# Altium schematic sheet connector.SchDoc
size A4; SheetNumber: 2; SheetTotal: 4
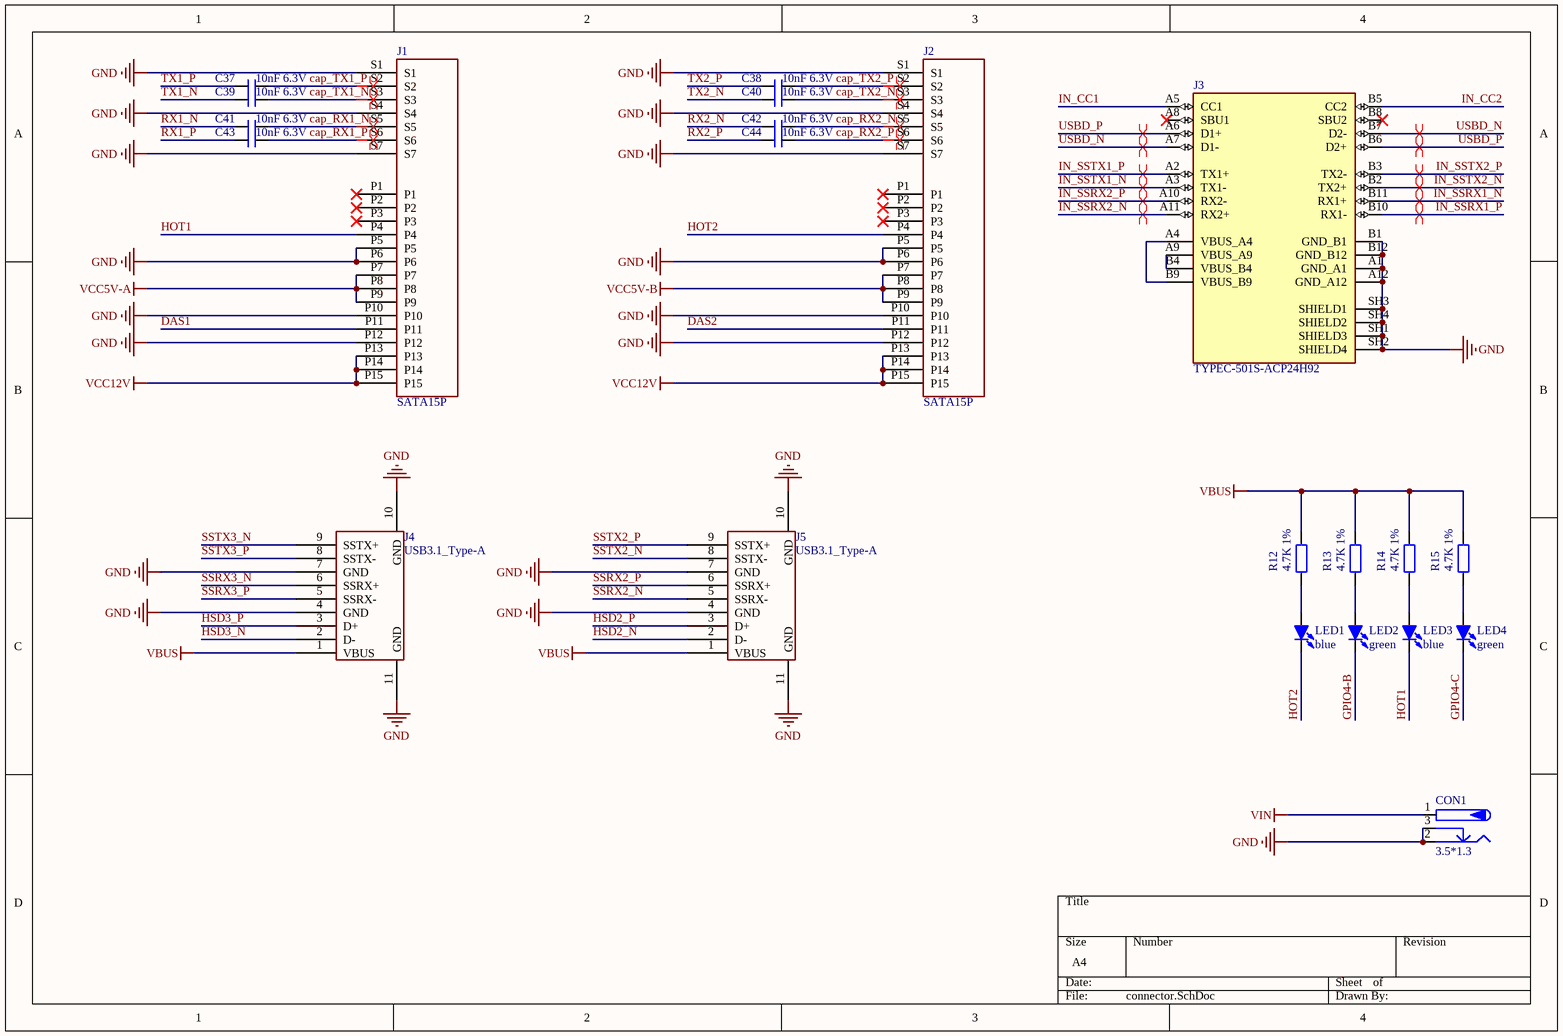
[diagram p0: connector.SchDoc]

## Parts
C37  10nF 6.3V  [C0402_L]
C38  10nF 6.3V  [C0402_L]
C39  10nF 6.3V  [C0402_L]
C40  10nF 6.3V  [C0402_L]
C41  10nF 6.3V  [C0402_L]
C42  10nF 6.3V  [C0402_L]
C43  10nF 6.3V  [C0402_L]
C44  10nF 6.3V  [C0402_L]
CON1  3.5*1.3  [DC-012G-2.5]
J1  SATA15P  [SATA 15P 贴片]
J2  SATA15P  [SATA 15P 贴片]
J3  TYPEC-501S-ACP24H92  [TypeC 24p 直立]
J4  USB3.1_Type-A  [USB3.1_Type-A 立式直插]
J5  USB3.1_Type-A  [USB3.1_Type-A 立式直插]
LED1  blue  [LED 0805B]
LED2  green  [LED 0805G]
LED3  blue  [LED 0805B]
LED4  green  [LED 0805G]
R12  4.7K 1%  [R0402_L]
R13  4.7K 1%  [R0402_L]
R14  4.7K 1%  [R0402_L]
R15  4.7K 1%  [R0402_L]

## Nets
GND: CON1.2 CON1.3 J1.P5 J1.P6 J1.P10 J1.P12 J1.S1 J1.S4 J1.S7 J2.P5 J2.P6 J2.P10 J2.P12 J2.S1 J2.S4 J2.S7 J3.A1(GND_A1) J3.A12(GND_A12) J3.B1(GND_B1) J3.B12(GND_B12) J3.SH1(SHIELD3) J3.SH2(SHIELD4) J3.SH3(SHIELD1) J3.SH4(SHIELD2) J4.4(GND) J4.7(GND) J4.10(GND) J4.11(GND) J5.4(GND) J5.7(GND) J5.10(GND) J5.11(GND)
VBUS: J4.1(VBUS) J5.1(VBUS) R12.1 R13.1 R14.1 R15.1
VCC5V-A: J1.P7 J1.P8 J1.P9
VCC5V-B: J2.P7 J2.P8 J2.P9
VCC12V: J1.P13 J1.P14 J1.P15 J2.P13 J2.P14 J2.P15
VIN: CON1.1
cap_RX1_N: C41.1 J1.S5
cap_RX1_P: C43.1 J1.S6
cap_RX2_N: C42.1 J2.S5
cap_RX2_P: C44.1 J2.S6
cap_TX1_N: C39.1 J1.S3
cap_TX1_P: C37.1 J1.S2
cap_TX2_N: C40.1 J2.S3
cap_TX2_P: C38.1 J2.S2
DAS1: J1.P11
DAS2: J2.P11
GPIO4-B: LED2.2(K)
GPIO4-C: LED4.2(K)
HOT1: J1.P4 LED3.2(K)
HOT2: J2.P4 LED1.2(K)
HSD2_N: J5.2(D-)
HSD2_P: J5.3(D+)
HSD3_N: J4.2(D-)
HSD3_P: J4.3(D+)
IN_CC1: J3.A5(CC1)
IN_CC2: J3.B5(CC2)
IN_SSRX1_N: J3.B11(RX1+)
IN_SSRX1_P: J3.B10(RX1-)
IN_SSRX2_N: J3.A11(RX2+)
IN_SSRX2_P: J3.A10(RX2-)
IN_SSTX1_N: J3.A3(TX1-)
IN_SSTX1_P: J3.A2(TX1+)
IN_SSTX2_N: J3.B2(TX2+)
IN_SSTX2_P: J3.B3(TX2-)
RX1_N: C41.2
RX1_P: C43.2
RX2_N: C42.2
RX2_P: C44.2
SSRX2_N: J5.5(SSRX-)
SSRX2_P: J5.6(SSRX+)
SSRX3_N: J4.6(SSRX+)
SSRX3_P: J4.5(SSRX-)
SSTX2_N: J5.8(SSTX-)
SSTX2_P: J5.9(SSTX+)
SSTX3_N: J4.9(SSTX+)
SSTX3_P: J4.8(SSTX-)
TX1_N: C39.2
TX1_P: C37.2
TX2_N: C40.2
TX2_P: C38.2
USBD_N: J3.A7(D1-) J3.B7(D2-)
USBD_P: J3.A6(D1+) J3.B6(D2+)
NetJ3_A4: J3.A4(VBUS_A4) J3.B9(VBUS_B9)
NetJ3_A9: J3.A9(VBUS_A9) J3.B4(VBUS_B4)
NetLED1_1: LED1.1(A) R12.2
NetLED2_1: LED2.1(A) R13.2
NetLED3_1: LED3.1(A) R14.2
NetLED4_1: LED4.1(A) R15.2

Not connected (* = marked no-connect by the designer): J1 P1* P2* P3*; J2 P1* P2* P3*; J3 A8(SBU1)* B8(SBU2)*

## Layout directives
differential pair: cap_RX1_N, cap_RX1_P, cap_RX2_N, cap_RX2_P, cap_TX1_N, cap_TX1_P, cap_TX2_N, cap_TX2_P, IN_SSRX1_N, IN_SSRX1_P, IN_SSRX2_N, IN_SSRX2_P, IN_SSTX1_N, IN_SSTX1_P, IN_SSTX2_N, IN_SSTX2_P, USBD_N, USBD_P

## Library data of the parts
C37-C44 = C: 无极性贴片电容; 版权归属: 源创客; 材质: X7R; BOM名称: 无极性贴片电容; 学习资源: www.ooocke.com
CON1 = P-DC: 低压电源接口; BOM名称: DC电源接口; 版权归属: 源创客; 学习资源: www.ooocke.com
J3 = Typec 24p: USB-C (USB TYPE-C) USB 3.2 Gen 2 (USB 3.1 Gen 2, Superspeed + (USB 3.1)) Receptacle Connector 24 Position Surface Mount, Right Angle; Through Hole; MF: Molex; MP: 1054500101; SnapEDA_Link: https://www.snapeda.com/parts/1054500101/Molex/view-part/?ref=snap; Package: None; Value: *; Check_prices: https://www.snapeda.com/parts/1054500101/Molex/view-part/?ref=eda
J4 J5 = USB3.1_Type-A: USB接口
LED1-LED4 = LED-3MM: 插件LED; 版权归属: 源创客; BOM名称: 插件LED; 学习资源: www.ooocke.com
R12-R15 = R: 贴片电阻; 版权归属: 源创客; BOM名称: 贴片电阻; 学习资源: www.ooocke.com